# EAGLE design Sensor_Module_0xXX_Prototyping_v1 (EAGLE 9.1.1)
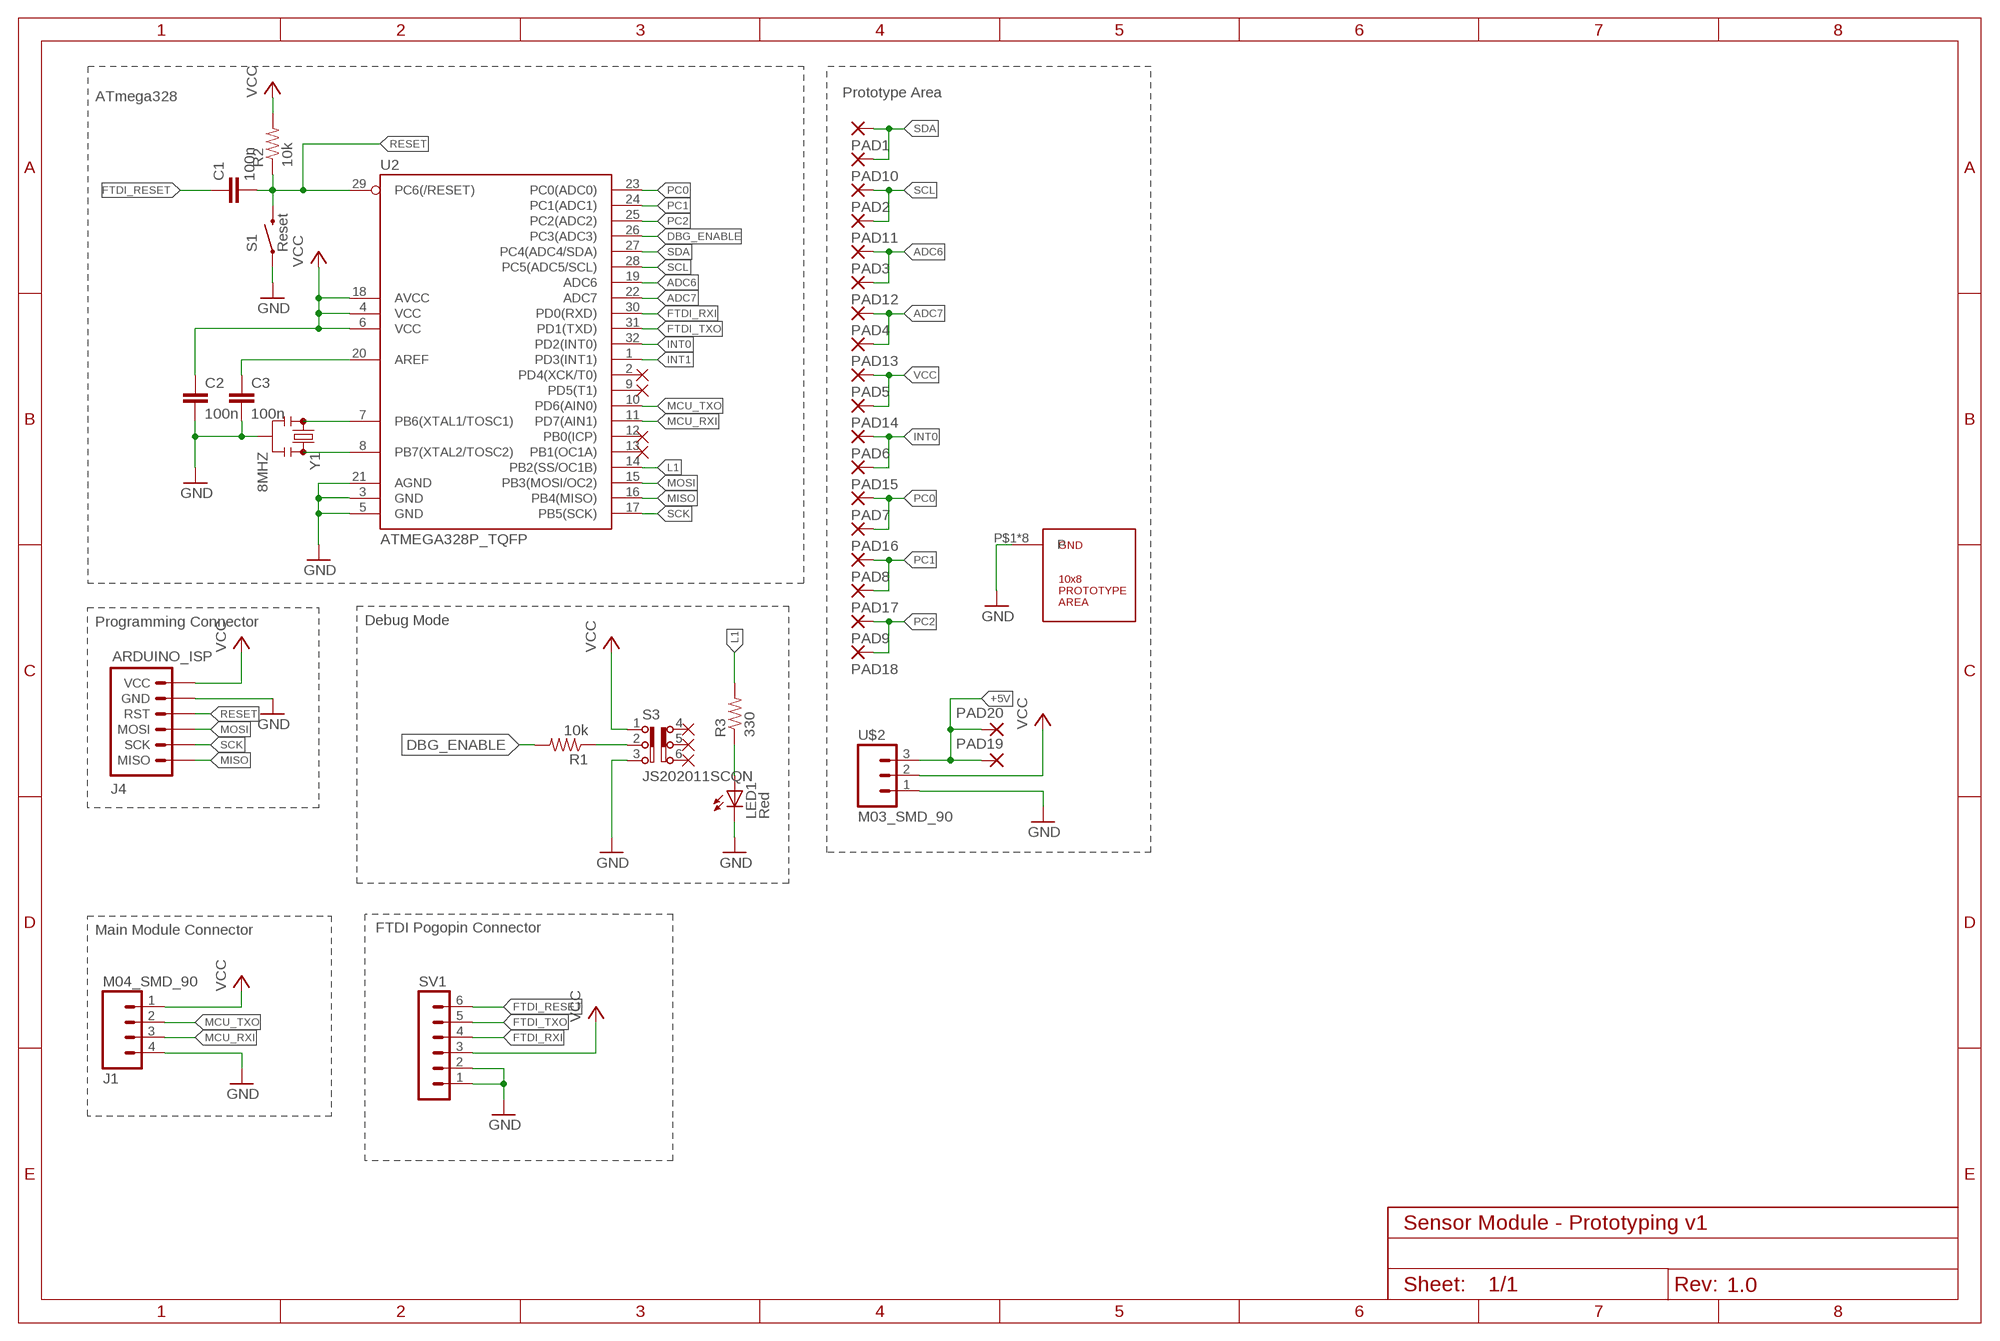
[diagram p0: schematic, sheet 1]
FRAME1 (FRAME-A4L): CNAME: Communication Module; CREVISION: 2.0

## Parts
C1  100n  C  [C0805]
C2  100n  C  [C0805]
C3  100n  C  [C0805]
J1  M04_SMD_90  [M04_SMD_90]
J4  ARDUINO_ISP  [M-2X3]
LED1  Red  LEDSML0805  [SML0805]
PAD1  1,6/0,9  [1,6/0,9]
PAD2  1,6/0,9  [1,6/0,9]
PAD3  1,6/0,9  [1,6/0,9]
PAD4  1,6/0,9  [1,6/0,9]
PAD5  1,6/0,9  [1,6/0,9]
PAD6  1,6/0,9  [1,6/0,9]
PAD7  1,6/0,9  [1,6/0,9]
PAD8  1,6/0,9  [1,6/0,9]
PAD9  1,6/0,9  [1,6/0,9]
PAD10  1,6/0,9  [1,6/0,9]
PAD11  1,6/0,9  [1,6/0,9]
PAD12  1,6/0,9  [1,6/0,9]
PAD13  1,6/0,9  [1,6/0,9]
PAD14  1,6/0,9  [1,6/0,9]
PAD15  1,6/0,9  [1,6/0,9]
PAD16  1,6/0,9  [1,6/0,9]
PAD17  1,6/0,9  [1,6/0,9]
PAD18  1,6/0,9  [1,6/0,9]
PAD19  1,6/0,9  [1,6/0,9]
PAD20  1,6/0,9  [1,6/0,9]
R1  10k  RESISTOR0805-RES  [0805]
R2  10k  RESISTOR0805-RES  [0805]
R3  330  RESISTOR0805-RES  [0805]
S1  Reset  PUSHBUTTON  [M-PUSHBUTTON-SMD]
S3  JS202011SCQN  [JS202011SCQN]
SV1  MA06-1  [MA06-1]
U2  ATMEGA328P_TQFP  [TQFP32-08]
U$1  10X8_PROTOTYPE_AREA  [10X8_PROTOTYPE_AREA]
U$2  M03_SMD_90  [M03_SMD_90]
Y1  8MHZ  RESONATOR8MHZ  [RESONATOR-SMD]

## Nets
+5V: PAD19.1(P) PAD20.1(P) U$2.3
ADC6: PAD3.1(P) PAD12.1(P) U2.19(ADC6)
ADC7: PAD4.1(P) PAD13.1(P) U2.22(ADC7)
DBG_ENABLE: R1.2 U2.26(PC3(ADC3))
FTDI_RESET: C1.1 SV1.6
FTDI_RXI: SV1.4 U2.30(PD0(RXD))
FTDI_TXO: SV1.5 U2.31(PD1(TXD))
GND [GND]: C2.2 C3.2 J1.4 J4.P$5(GND) LED1.C S1.1(LEFT) S1.2(LEFT) S3.3 SV1.1 SV1.2 U2.3(GND) U2.5(GND) U2.21(AGND) U$1.P$1(P) U$1.P$2(P) U$1.P$3(P) U$1.P$4(P) U$1.P$5(P) U$1.P$6(P) U$1.P$7(P) U$1.P$8(P) U$2.1 Y1.2
INT0: PAD6.1(P) PAD15.1(P) U2.32(PD2(INT0))
INT1: U2.1(PD3(INT1))
L1: R3.2 U2.14(PB2(SS/OC1B))
MCU_RXI: J1.3 U2.11(PD7(AIN1))
MCU_TXO: J1.2 U2.10(PD6(AIN0))
MISO: J4.P$1(MISO) U2.16(PB4(MISO))
MOSI: J4.P$3(MOSI) U2.15(PB3(MOSI/OC2))
N$1: U2.8(PB7(XTAL2/TOSC2)) Y1.3
N$2: U2.7(PB6(XTAL1/TOSC1)) Y1.1
N$3: R1.1 S3.2
N$15: C3.1 U2.20(AREF)
N$30: LED1.A R3.1
PC0: PAD7.1(P) PAD16.1(P) U2.23(PC0(ADC0))
PC1: PAD8.1(P) PAD17.1(P) U2.24(PC1(ADC1))
PC2: PAD9.1(P) PAD18.1(P) U2.25(PC2(ADC2))
RESET: C1.2 J4.P$4(RST) R2.1 S1.3(RIGHT) S1.4(RIGHT) U2.29(PC6(/RESET))
SCK: J4.P$2(SCK) U2.17(PB5(SCK))
SCL: PAD2.1(P) PAD11.1(P) U2.28(PC5(ADC5/SCL))
SDA: PAD1.1(P) PAD10.1(P) U2.27(PC4(ADC4/SDA))
VCC [Vsupply]: C2.1 J1.1 J4.P$6(VCC) PAD5.1(P) PAD14.1(P) R2.2 S3.1 SV1.3 U2.4(VCC) U2.6(VCC) U2.18(AVCC) U$2.2
Unconnected: S3.4 S3.5 S3.6 U2.2(PD4(XCK/T0)) U2.9(PD5(T1)) U2.12(PB0(ICP)) U2.13(PB1(OC1A))

## Notes on the sheet
- ATmega328 | Prototype Area
- Programming Connector | Debug Mode
- Main Module Connector | FTDI Pogopin Connector
- Sensor Module - Prototyping v1
- 1.0

## Library data of the parts
C1-C3 = eagle-ltspice:C: CAPACITOR, European symbol; SPICEMODEL: NONE; SPICEPREFIX: C
J1 = myownthings:M04_SMD_90
J4 = marc_library:ARDUINO_ISP: AVR ISP 6-pin inline header for Arduino ISP
LED1 = led:LED: LED OSRAM: - CHIPLED LG R971, LG N971, LY N971, LG Q971, LY Q971, LO R971, LY R971 LH N974, LH R974 LS Q976, LO Q976, LY Q976 LO Q996 - Hyper CHIPLED LW Q18S LB Q993, LB Q99A, LB R99A - SideLED LS A670, LO A670, LY A670, LG A670, LP A670 LB A673, LV A673, LT A673, LW A673 LH A674 LY A675 LS A676, LA A676, LO A676, LY A676, LW A676 LS A679, LY A679, LG A679 - Hyper Micro SIDELED® LS Y876, LA Y876, LO Y876, LY Y876 LT Y87S - SmartLED LW L88C, LW L88S LB L89C, LB L89S, LG L890 LS L89K, LO L89K, LY L89K LS L896, LA L896, LO L896, LY L896 - TOPLED LS T670, LO T670, LY T670, LG T670, LP T670 LSG T670, LSP T670, LSY T670, LOP T670, LYG T670 LG T671, LOG T671, LSG T671 LB T673, LV T673, LT T673, LW T673 LH T674 LS T676, LA T676, LO T676, LY T676, LB T676, LH T676, LSB T676, LW T676 LB T67C, LV T67C, LT T67C, LS T67K, LO T67K, LY T67K, LW E67C LS E67B, LA E67B, LO E67B, LY E67B, LB E67C, LV E67C, LT E67C LW T67C LS T679, LY T679, LG T679 LS T770, LO T770, LY T770, LG T770, LP T770 LB T773, LV T773, LT T773, LW T773 LH T774 LS E675, LA E675, LY E675, LS T675 LS T776, LA T776, LO T776, LY T776, LB T776 LHGB T686 LT T68C, LB T68C - Hyper Mini TOPLED® LB M676 - Mini TOPLED Santana® LG M470 LS M47K, LO M47K, LY M47K Source: http://www.osram.convergy.de LUXEON: - LUMILED® LXK2-PW12-R00, LXK2-PW12-S00, LXK2-PW14-U00, LXK2-PW14-V00 LXK2-PM12-R00, LXK2-PM12-S00, LXK2-PM14-U00 LXK2-PE12-Q00, LXK2-PE12-R00, LXK2-PE12-S00, LXK2-PE14-T00, LXK2-PE14-U00 LXK2-PB12-K00, LXK2-PB12-L00, LXK2-PB12-M00, LXK2-PB14-N00, LXK2-PB14-P00, LXK2-PB14-Q00 LXK2-PR12-L00, LXK2-PR12-M00, LXK2-PR14-Q00, LXK2-PR14-R00 LXK2-PD12-Q00, LXK2-PD12-R00, LXK2-PD12-S00 LXK2-PH12-R00, LXK2-PH12-S00 LXK2-PL12-P00, LXK2-PL12-Q00, LXK2-PL12-R00 Source: www.luxeon.com KINGBRIGHT: KA-3528ASYC Source: www.kingbright.com
PAD1-PAD20 = wirepad:1,6/0,9: THROUGH-HOLE PAD
R1-R3 = SparkFun-Passives:RESISTOR: Resistor Basic schematic elements and footprints for 0603, 1206, and PTH resistors.
S1 = marc_library:PUSHBUTTON
S3 = myownthings:JS202011SCQN: DPDT SLIDE SWITCH
SV1 = con-lstb:MA06-1: PIN HEADER; OC_FARNELL: unknown; OC_NEWARK: unknown
U2 = marc_library:ATMEGA328P_TQFP; PROD_ID: IC-09069
U$1 = myownthings:10X8_PROTOTYPE_AREA
U$2 = myownthings:M03_SMD_90
Y1 = marc_library:RESONATOR: Resonator Small SMD resonator. Used, eg, on the Arduino Pro/ Pro Mini boards. 8MHz- XTAL-08895 16MHz- XTAL-08900; PROD_ID: XTAL-08895

## Net classes
0 default: width 0.3 mm
1 Vsupply: width 0.5 mm
5 GND: width 0.5 mm

## Board
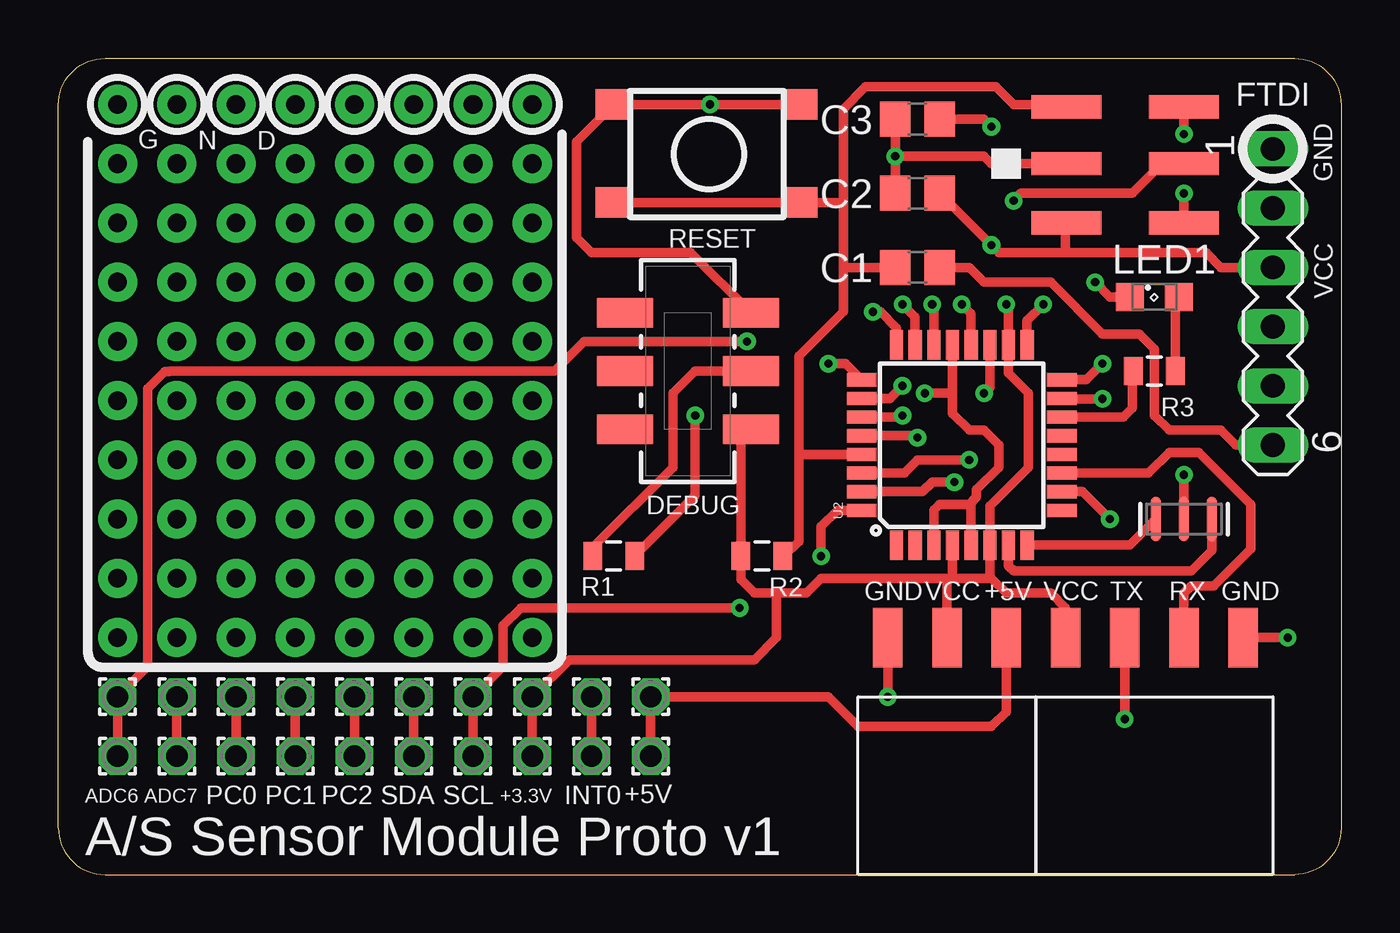
[diagram p1: board, top side]
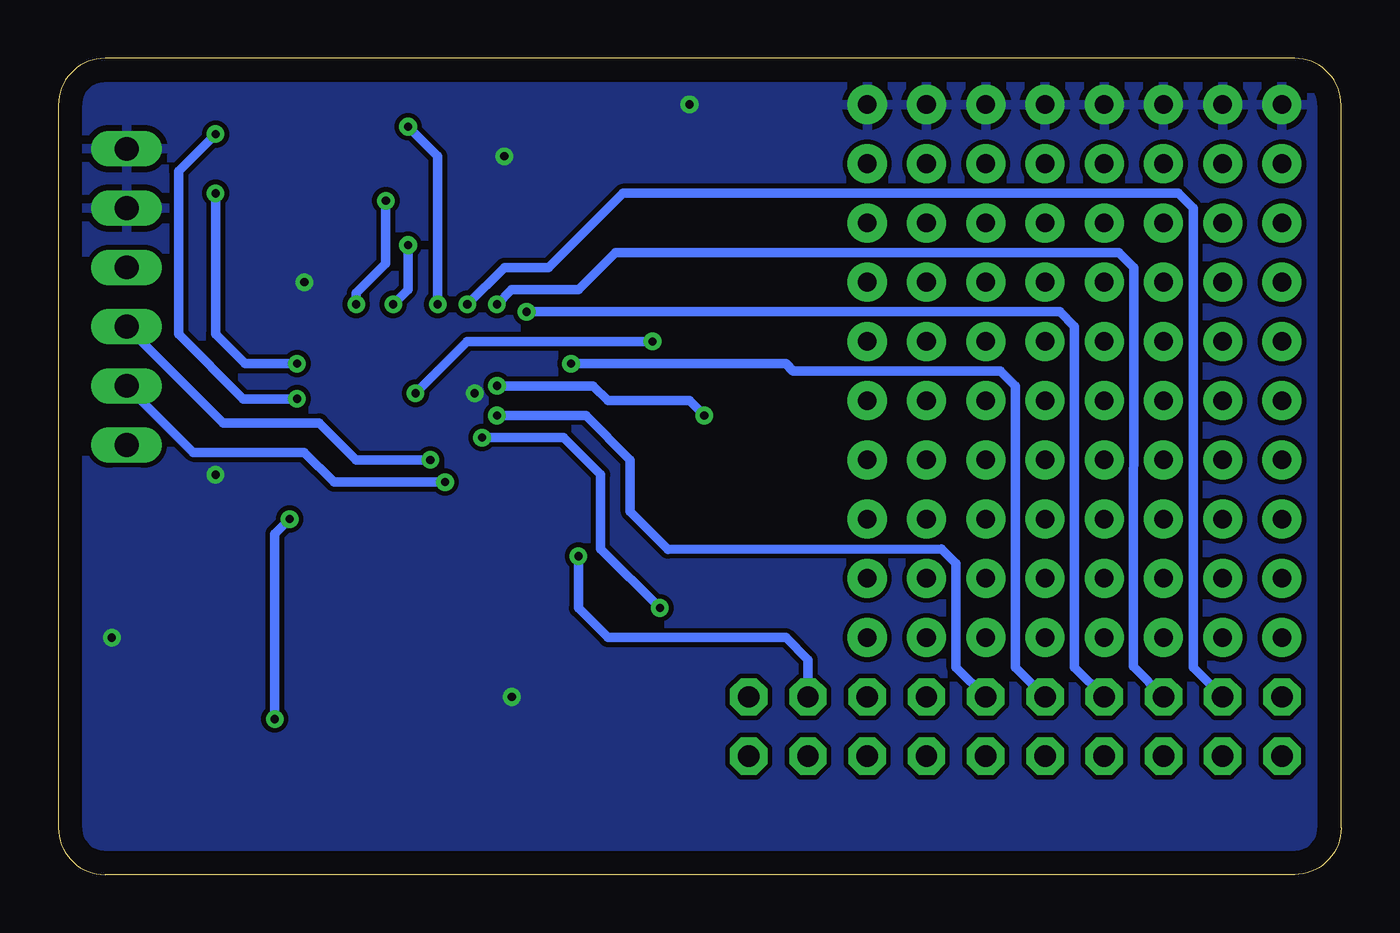
[diagram p2: board, bottom side, seen from below]

Size 55 x 35 mm. Coordinates in mm from the lower left corner, seen from the top.
Outline: 55,33 55,2 arc-90 53,0 2,0 arc-90 0,2 0,33 arc-90 2,35 53,35 arc-90 55,33
Copper layers (1*16): Top 0.035mm / dielectric 1.5mm / Bottom 0.035mm
Design rules "default *": minimum track width 14mil, minimum drill 24mil, track to track 8mil, track to pad 8mil, pad to pad 8mil, via to via 8mil, smd to smd 8mil, copper to edge 40mil, drill to drill 8mil, minimum pad ring 10mil, minimum via ring 8mil, stop-mask expansion 4mil, vias tented up to drill 0mil, thermal gap 10mil

### Footprints (pad centres in the part's own frame; a part is rotated, then mirrored left to right if it is on the bottom)
C0805 = smd 1.3 x 1.5: 1 -0.95,0; 2 0.95,0
M04_SMD_90 = smd 1.27 x 2.54: 1 0,0; 2 2.54,0; 3 5.08,0; 4 7.62,0
M-2X3 = smd 1 x 3: P$1 0,0; P$2 2.54,0; P$3 4.98,0; P$4 4.98,5.05; P$5 2.54,5.05; P$6 0,5.05
SML0805 = smd 1.2 x 1.2: A 1.05,0; C -1.05,0
1,6/0,9 = drill 0.914 pad 1.6 octagon: 1 0,0
0805 = smd 0.8 x 1.2: 1 -0.9,0; 2 0.9,0
M-PUSHBUTTON-SMD = smd 1.55 x 1.3: 1 0,0; 2 7.95,0; 3 0,-4.2; 4 7.95,-4.2
JS202011SCQN = smd 1.27 x 2.4: 1 -2.5,-2.7; 2 0,-2.7; 3 2.5,-2.7; 4 -2.5,2.7; 5 0,2.7; 6 2.5,2.7
MA06-1 = drill 1.016 long: 1 -6.35,0; 2 -3.81,0; 3 -1.27,0; 4 1.27,0; 5 3.81,0; 6 6.35,0
TQFP32-08 = smd 1.27 x 0.559: 1 -4.293,2.8; 2 -4.293,2; 3 -4.293,1.2; 4 -4.293,0.4; 5 -4.293,-0.4; 6 -4.293,-1.2; 7 -4.293,-2; 8 -4.293,-2.8; 17 4.293,-2.8; 18 4.293,-2; 19 4.293,-1.2; 20 4.293,-0.4; 21 4.293,0.4; 22 4.293,1.2; 23 4.293,2; 24 4.293,2.8 | smd 0.559 x 1.27: 9 -2.8,-4.293; 10 -2,-4.293; 11 -1.2,-4.293; 12 -0.4,-4.293; 13 0.4,-4.293; 14 1.2,-4.293; 15 2,-4.293; 16 2.8,-4.293; 25 2.8,4.293; 26 2,4.293; 27 1.2,4.293; 28 0.4,4.293; 29 -0.4,4.293; 30 -1.2,4.293; 31 -2,4.293; 32 -2.8,4.293
10X8_PROTOTYPE_AREA = drill 0.8 pad 1.676: P$1 0,0; P$2 2.54,0; P$3 5.08,0; P$4 7.62,0; P$5 10.16,0; P$6 12.7,0; P$7 15.24,0; P$8 17.78,0; P$9 0,-2.54; P$10 2.54,-2.54; P$11 5.08,-2.54; P$12 7.62,-2.54; P$13 10.16,-2.54; P$14 12.7,-2.54; P$15 15.24,-2.54; P$16 17.78,-2.54; P$17 0,-5.08; P$18 2.54,-5.08; P$19 5.08,-5.08; P$20 7.62,-5.08; P$21 10.16,-5.08; P$22 12.7,-5.08; P$23 15.24,-5.08; P$24 17.78,-5.08; P$25 0,-7.62; P$26 2.54,-7.62; P$27 5.08,-7.62; P$28 7.62,-7.62; P$29 10.16,-7.62; P$30 12.7,-7.62; P$31 15.24,-7.62; P$32 17.78,-7.62; P$33 0,-10.16; P$34 2.54,-10.16; P$35 5.08,-10.16; P$36 7.62,-10.16; P$37 10.16,-10.16; P$38 12.7,-10.16; P$39 15.24,-10.16; P$40 17.78,-10.16; P$41 0,-12.7; P$42 2.54,-12.7; P$43 5.08,-12.7; P$44 7.62,-12.7; P$45 10.16,-12.7; P$46 12.7,-12.7; P$47 15.24,-12.7; P$48 17.78,-12.7; P$49 0,-15.24; P$50 2.54,-15.24; P$51 5.08,-15.24; P$52 7.62,-15.24; P$53 10.16,-15.24; P$54 12.7,-15.24; P$55 15.24,-15.24; P$56 17.78,-15.24; P$57 0,-17.78; P$58 2.54,-17.78; P$59 5.08,-17.78; P$60 7.62,-17.78; P$61 10.16,-17.78; P$62 12.7,-17.78; P$63 15.24,-17.78; P$64 17.78,-17.78; P$65 0,-20.32; P$66 2.54,-20.32; P$67 5.08,-20.32; P$68 7.62,-20.32; P$69 10.16,-20.32; P$70 12.7,-20.32; P$71 15.24,-20.32; P$72 17.78,-20.32; P$73 0,-22.86; P$74 2.54,-22.86; P$75 5.08,-22.86; P$76 7.62,-22.86; P$77 10.16,-22.86; P$78 12.7,-22.86; P$79 15.24,-22.86; P$80 17.78,-22.86
M03_SMD_90 = smd 1.27 x 2.54: 1 0,0; 2 2.54,0; 3 5.08,0
RESONATOR-SMD = smd 0.45 x 1.905: 1 -1.2,0; 2 0,0; 3 1.2,0

### Placement (x,y rotation side)
C1  36.83,26.04 180 top
C2  36.83,29.21 180 top
C3  36.83,32.38 180 top
J1  43.18,10.16 0 top
J4  48.26,27.94 90 top
LED1  46.99,24.77 0 top
PAD1  15.24,5.08 180 top
PAD2  17.78,5.08 180 top
PAD3  2.54,5.08 180 top
PAD4  5.08,5.08 180 top
PAD5  20.32,5.08 180 top
PAD6  22.86,5.08 180 top
PAD7  7.62,5.08 180 top
PAD8  10.16,5.08 180 top
PAD9  12.7,5.08 180 top
PAD10  15.24,7.62 180 top
PAD11  17.78,7.62 180 top
PAD12  2.54,7.62 180 top
PAD13  5.08,7.62 180 top
PAD14  20.32,7.62 180 top
PAD15  22.86,7.62 180 top
PAD16  7.62,7.62 180 top
PAD17  10.16,7.62 180 top
PAD18  12.7,7.62 180 top
PAD19  25.4,7.62 0 top
PAD20  25.4,5.08 0 top
R1  23.81,13.65 0 top
R2  30.16,13.65 180 top
R3  46.99,21.59 180 top
S1  23.81,33.02 0 top
S3  26.99,21.59 90 top
SV1  52.07,24.77 270 top
U2  38.73,18.41 90 top
U$1  2.54,33.02 0 top
U$2  35.56,10.16 0 top
Y1  48.26,15.24 180 top

### Tracks (layer width: path | path; a pad name or v marks a point on that pad's centre or on a via)
+5V
  Top 0.406: U$2.3 40.64,6.99 40.01,6.35 34.29,6.35 33.02,7.62 PAD19.1 PAD20.1
ADC6  (via drill 0.35)
  Top 0.406: v29.53,22.86 22.54,22.86 21.27,21.59 4.79,21.59 4.76,21.57 4.56,21.57 3.83,20.84 3.83,8.91 PAD12.1 PAD3.1 | U2.19 39.94,20.89 v39.69,20.64
  Bottom 0.406: v29.53,22.86 37.47,22.86 v39.69,20.64
ADC7  (via drill 0.35)
  Top 0.406: v37.47,24.45 37.53,24.38 U2.22 | PAD4.1 PAD13.1
  Bottom 0.406: PAD13.1 6.35,8.89 6.35,28.57 6.99,29.21 30.8,29.21 33.97,26.04 35.88,26.04 v37.47,24.45
DBG_ENABLE  (via drill 0.35)
  Top 0.406: R1.2 27.3,16.25 v27.3,19.68 | U2.26 35.65,20.41 v36.19,20.95
  Bottom 0.406: v27.3,19.68 27.94,20.32 31.43,20.32 32.07,20.95 v36.19,20.95
FTDI_RESET
  Top 0.406: C1.1 39.05,26.04 39.69,25.4 42.55,25.4 44.77,23.18 46.35,23.18 46.99,22.54 46.99,19.68 47.62,19.05 49.85,19.05 50.48,18.41 SV1.6
FTDI_RXI  (via drill 0.35)
  Top 0.406: v39.05,17.78 36.83,17.78 36.27,17.21 U2.30
  Bottom 0.406: SV1.4 47.94,19.37 43.81,19.37 42.23,17.78 v39.05,17.78
FTDI_TXO  (via drill 0.35)
  Top 0.406: v38.42,16.83 37.47,16.83 37.05,16.41 U2.31
  Bottom 0.406: SV1.5 49.21,18.1 44.45,18.1 43.18,16.83 v38.42,16.83
GND  (via drill 0.35)
  Top 0.406: Y1.2 v48.26,17.14 | v52.7,10.16 J1.4 | v44.45,25.4 45.09,24.77 LED1.C | S1.2 v27.94,33.02 S1.1 22.23,31.43 22.23,27.3 22.86,26.67 27.11,26.67 S3.3 29.84,24.25 | 38.34,20.64 38.34,19.77 39.05,19.05 39.69,19.05 40.32,18.41 40.32,17.46 39.37,16.51 39.37,16.19 39.05,15.88 | 38.34,20.64 U2.21 | U2.5 39.13,15.88 39.05,15.88 | U2.3 37.53,15.63 37.78,15.88 39.05,15.88 | v37.15,20.64 38.34,20.64 | C3.2 v35.88,30.8 | v35.88,30.8 C2.2 | v35.88,30.8 39.69,30.8 40.01,30.48 J4.P$5 | U$2.1 v35.56,7.62
  pour Bottom: 55,33 55,2 arc-90 53,0 2,0 arc-90 0,2 0,33 arc-90 2,35 53,35 arc-90
INT0  (via drill 0.35)
  Top 0.406: PAD6.1 PAD15.1 | U2.32 33.4,15.62 32.7,14.92 v32.7,13.65
  Bottom 0.406: v32.7,13.65 32.7,11.43 31.43,10.16 23.81,10.16 22.86,9.21 PAD15.1
L1
  Top 0.406: R3.2 46.04,21.54 46.04,20 45.65,19.61 U2.14
MCU_RXI
  Top 0.406: U2.11 46.74,17.21 47.62,18.1 48.9,18.1 51.12,15.88 51.12,13.97 49.53,12.38 48.58,12.38 48.26,12.06 J1.3
MCU_TXO  (via drill 0.35)
  Top 0.406: U2.10 43.91,16.41 v45.09,15.24 | v45.72,6.67 J1.2
  Bottom 0.406: v45.09,15.24 45.72,14.61 v45.72,6.67
MISO  (via drill 0.35)
  Top 0.406: J4.P$1 v48.26,29.21 | U2.16 44.08,21.21 v44.77,21.91
  Bottom 0.406: v48.26,29.21 48.26,23.18 46.99,21.91 v44.77,21.91
MOSI  (via drill 0.35)
  Top 0.406: J4.P$3 v48.26,31.75 | v44.77,20.4 43.04,20.4 U2.15
  Bottom 0.406: v48.26,31.75 49.85,30.16 49.85,23.18 47.07,20.4 v44.77,20.4
N$1
  Top 0.406: U2.8 45.94,14.12 Y1.3
N$2
  Top 0.406: Y1.1 49.46,13.9 48.58,13.02 40.96,13.02 40.73,13.24 U2.7
N$3
  Top 0.406: R1.1 22.91,14.02 26.35,17.46 26.35,20.64 27.3,21.59 S3.2
N$15  (via drill 0.35)
  Top 0.406: C3.1 39.69,32.38 v40.01,32.07 | U2.20 39.13,24.05 v38.73,24.45
  Bottom 0.406: v40.01,32.07 38.73,30.8 v38.73,24.45
N$30
  Top 0.406: LED1.A 47.89,24.61 R3.1
PC0  (via drill 0.35)
  Top 0.406: 36.42,24.23 v36.2,24.45 36.73,23.91 U2.23 | PAD7.1 PAD16.1
  Bottom 0.406: PAD16.1 8.91,8.91 8.89,26.04 9.53,26.67 31.11,26.67 32.7,25.08 35.56,25.08 v36.2,24.45
PC1  (via drill 0.35)
  Top 0.406: v34.92,24.13 35.24,24.13 35.94,23.44 U2.24 | PAD8.1 PAD17.1
  Bottom 0.406: PAD17.1 11.43,8.89 11.43,23.5 12.06,24.13 v34.92,24.13
PC2  (via drill 0.35)
  Top 0.406: v33.02,21.91 33.75,21.91 U2.25 | PAD9.1 PAD18.1
  Bottom 0.406: PAD18.1 13.97,8.89 13.97,20.95 14.61,21.59 23.5,21.59 23.81,21.91 v33.02,21.91
RESET
  Top 0.406: J4.P$4 43.11,33.02 40.96,33.02 40.2,33.78 34.61,33.78 33.66,32.83 33.66,28.89 | 33.66,26.04 33.66,28.89 | 33.66,26.04 33.66,24.13 31.75,22.23 31.75,18.1 | 31.75,18.1 31.75,14.29 31.11,13.65 R2.1 | U2.29 31.83,18.02 31.75,18.1 | S1.3 S1.4 33.58,28.82 33.66,28.89 | C1.2 33.66,26.04
SCK  (via drill 0.35)
  Top 0.406: J4.P$2 47.31,30.48 46.04,29.21 41.27,29.21 v40.96,28.89 | U2.17 41.53,23.75 v42.23,24.45
  Bottom 0.406: v40.96,28.89 40.96,26.2 42.23,24.93 v42.23,24.45
SCL  (via drill 0.35)
  Top 0.406: v29.21,11.43 19.83,11.43 19.07,10.68 19.07,8.91 PAD11.1 PAD2.1 | U2.28 36.75,18.82 v36.83,18.73
  Bottom 0.406: v29.21,11.43 31.75,13.97 31.75,17.14 33.34,18.73 v36.83,18.73
SDA  (via drill 0.35)
  Top 0.406: v36.2,19.68 36.12,19.61 U2.27 | PAD1.1 PAD10.1
  Bottom 0.406: PAD10.1 16.51,8.89 16.51,13.34 17.14,13.97 28.87,13.95 30.48,15.56 30.48,17.78 32.38,19.68 v36.2,19.68
VCC  (via drill 0.35)
  Top 0.406: 43.18,26.67 49.21,26.67 49.85,26.04 SV1.3 | J4.P$6 43.18,27.91 43.18,26.67 | J1.1 43.18,11.43 42.55,12.06 40.64,12.06 40.01,12.7 | 38.42,12.7 40.01,12.7 | 38.1,12.7 38.42,12.7 | 38.1,12.7 32.7,12.7 32.07,12.06 30.8,12.06 | 29.21,13.6 R2.2 | 38.42,12.7 38.34,12.78 U2.4 | 40.01,12.7 39.94,12.77 U2.6 39.94,15.8 41.59,17.46 41.59,20.64 40.73,21.5 U2.18 40.73,24.35 v40.64,24.45 | U$2.2 38.1,12.7 | R2.2 29.26,12.65 29.84,12.06 30.8,12.06 | R2.2 29.26,18.66 S3.1 | 43.18,26.67 40.32,26.67 v40.01,26.99 C2.1 | PAD5.1 PAD14.1 21.91,9.21 29.84,9.21 30.8,10.16 30.8,12.06
  Bottom 0.406: v40.01,26.99 40.01,25.08 v40.64,24.45

### Text on the board
tPlace: FTDI | GND | G | N | D | RESET | VCC | DEBUG | GND | VCC | +5V | VCC | TX | RX | GND | ADC6 | ADC7 | PC0 | PC1 | PC2 | SDA | SCL | +3.3V | INT0 | +5V | A/S Sensor Module Proto v1